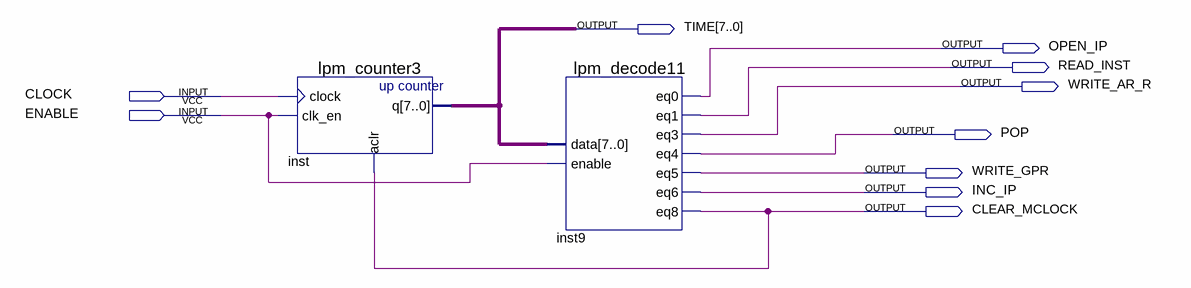
[diagram p0: schematic sheet]
// Quartus schematic POP.bdf as structural Verilog: 2 symbols, 10 pins
module POP (
  input  CLOCK,
  input  ENABLE,
  output [7:0] TIME,
  output OPEN_IP,
  output READ_INST,
  output WRITE_AR_R,
  output POP,
  output WRITE_GPR,
  output INC_IP,
  output CLEAR_MCLOCK
);

  lpm_counter3 inst (.clock(CLOCK), .clk_en(ENABLE), .aclr(CLEAR_MCLOCK), .q(TIME));
  lpm_decode11 inst9 (
    .data(TIME), .enable(ENABLE), .eq0(OPEN_IP), .eq1(READ_INST), .eq3(WRITE_AR_R), .eq4(POP),
    .eq5(WRITE_GPR), .eq6(INC_IP), .eq8(CLEAR_MCLOCK));
endmodule
